# Altium schematic sheet keycard.SchDoc
size A; SheetNumber: 1; SheetTotal: 1
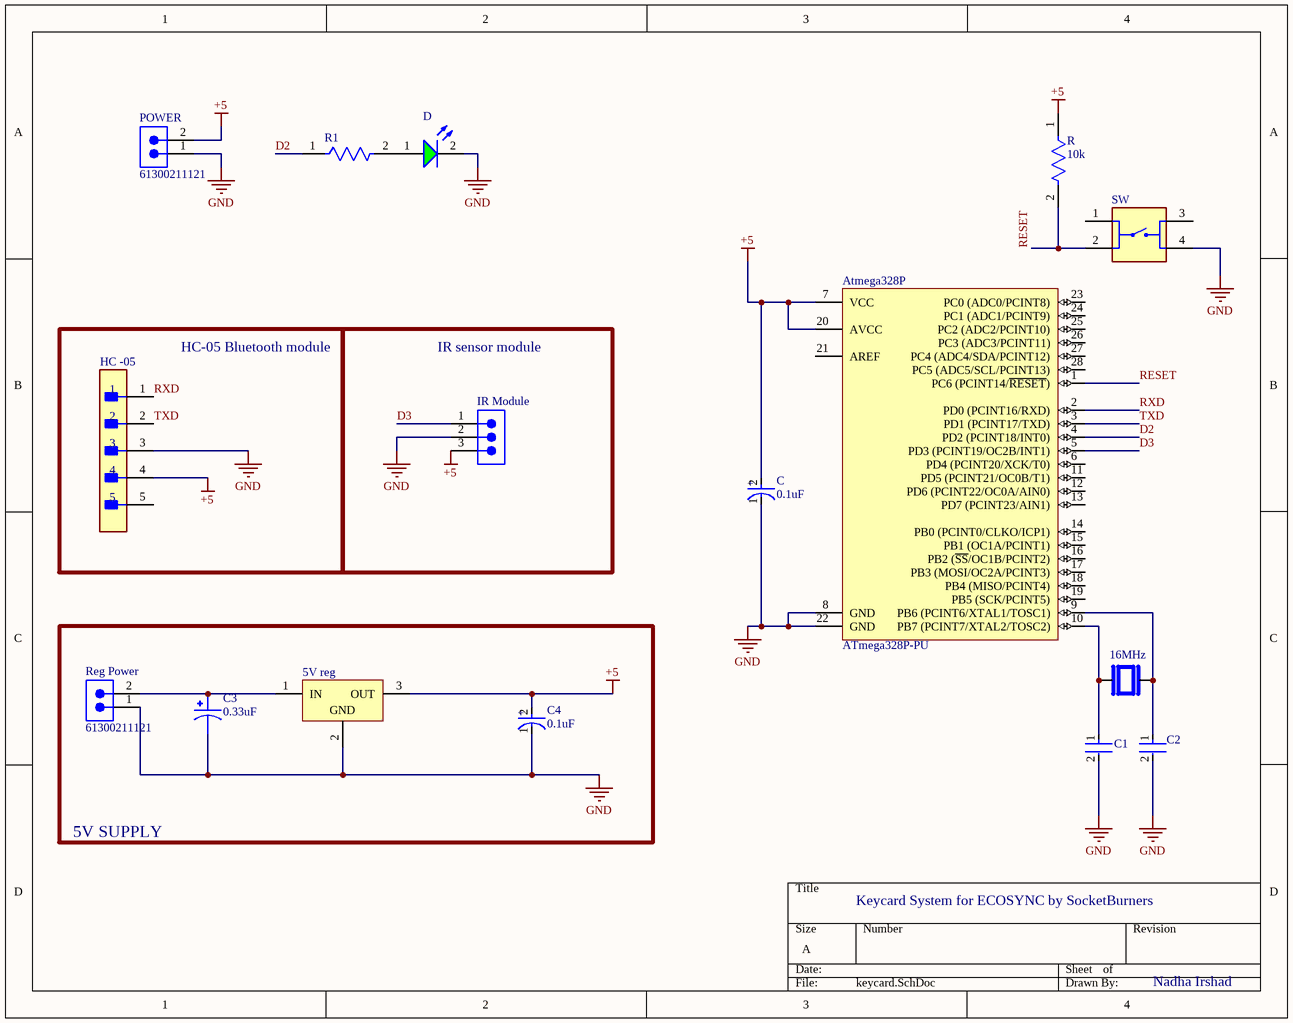
[diagram p0: keycard.SchDoc]

## Parts
5V_reg  L7805CV  [TO220]  (value not drawn)
16MHz  ABL-16.000MHZ-B2  [XTAL_HC49P488W46L1150T500H350]  (value not drawn)
Atmega328P  ATmega328P-PU  [28P3]
C  0.1uF  [FP-RAD-TH-D_6_3_0_5-L_11-MFG]
C1  RDE5C2A220J0M1H03A  [FP-RDE0M1-MFG]  (value not drawn)
C2  RDE5C2A220J0M1H03A  [FP-RDE0M1-MFG]  (value not drawn)
C3  0.33uF  [CAPPRD200W50D550H1250]
C4  0.1uF  [FP-RAD-TH-D_6_3_0_5-L_11-MFG]
D  151031VS06000  [WL-TMRC_D3.95H5.3]  (value not drawn)
HC_-05  22-28-4050  [FP-22-28-4050-MFG]  (value not drawn)
IR_Module  61300311121  [61300311121]  (value not drawn)
POWER  61300211121  [61300211121]
R  10k  [FP-CF18-MFG]
R1  CF18JT10K0  [FP-CF18-MFG]  (value not drawn)
Reg_Power  61300211121  [61300211121]
SW  1825910-6  [SW_1825910-6-4]  (value not drawn)

## Blocks framed on the sheet
HC-05 Bluetooth module: HC_-05
IR sensor module: IR_Module
5V SUPPLY: 5V_reg C3 C4 Reg_Power

## Nets
+5: 5V_reg.3(OUT) Atmega328P.7(VCC) Atmega328P.20(AVCC) C.2(A) C4.2(A) HC_-05.4 IR_Module.3 POWER.2 R.1
GND: 5V_reg.2(GND) Atmega328P.8(GND) Atmega328P.22(GND) C.1(C) C1.2 C2.2 C3.2 C4.1(C) D.2(K) HC_-05.3 IR_Module.2 POWER.1 Reg_Power.1 SW.4
D2: Atmega328P.4(PD2_(PCINT18/INT0)) R1.1
D3: Atmega328P.5(PD3_(PCINT19/OC2B/INT1)) IR_Module.1
RESET: Atmega328P.1(PC6_(PCINT14/~{RESET})) R.2 SW.2
RXD: Atmega328P.2(PD0_(PCINT16/RXD)) HC_-05.1
TXD: Atmega328P.3(PD1_(PCINT17/TXD)) HC_-05.2
Net5V_reg_1: 5V_reg.1(IN) C3.1 Reg_Power.2
Net16MHz_1: 16MHz.1 Atmega328P.10(PB7_(PCINT7/XTAL2/TOSC2)) C1.1
Net16MHz_2: 16MHz.2 Atmega328P.9(PB6_(PCINT6/XTAL1/TOSC1)) C2.1
NetD_1: D.1(A) R1.2

Not connected (* = marked no-connect by the designer): Atmega328P 6(PD4_(PCINT20/XCK/T0)) 11(PD5_(PCINT21/OC0B/T1)) 12(PD6_(PCINT22/OC0A/AIN0)) 13(PD7_(PCINT23/AIN1)) 14(PB0_(PCINT0/CLKO/ICP1)) 15(PB1_(OC1A/PCINT1)) 16(PB2_(~{SS}/OC1B/PCINT2)) 17(PB3_(MOSI/OC2A/PCINT3)) 18(PB4_(MISO/PCINT4)) 19(PB5_(SCK/PCINT5)) 21(AREF) 23(PC0_(ADC0/PCINT8)) 24(PC1_(ADC1/PCINT9)) 25(PC2_(ADC2/PCINT10)) 26(PC3_(ADC3/PCINT11)) 27(PC4_(ADC4/SDA/PCINT12)) 28(PC5_(ADC5/SCL/PCINT13)); HC_-05 5; SW 1 3

## Notes on the sheet
- Keycard System for ECOSYNC by SocketBurners
- Nadha Irshad
- (in symbol CMP-05427-001214-1) +

## Library data of the parts
5V_reg = CMP-0244-00483-1: Positive Voltage Regulator, 5V, 3-Pin TO-220; PackageDescription: TO, Thru-Hole, Vertical, Heatsink Mounted; 3 In-Line Leads; Pitch 2.54 mm; ComponentLink2Description: Datasheet; PackageReference: TO220; ComponentLink3URL: http://www.st.com/internet/com/TECHNICAL_RESOURCES/TECHNICAL_LITERATURE/PACKAGE_INFORMATION/CD00004649.pdf; DatasheetVersion: 16/11/2011; ComponentLink1Description: Manufacturer URL; ComponentLink1URL: http://www.st.com; PackageVersion: ver3.0; ComponentLink3Description: Package Specification; ComponentLink2URL: http://www.st.com/internet/com/TECHNICAL_RESOURCES/TECHNICAL_LITERATURE/DATASHEET/CD00000444.pdf
16MHz = ABL-16.000MHZ-B2: HC/49US (AT49) MICROPROCESSOR CRYSTAL; MF: Abracon; Availability: In Stock; SnapEDA_Link: https://www.snapeda.com/parts/ABL-16.000MHZ-B2/Abracon+LLC/view-part/?ref=snap; MP: ABL-16.000MHZ-B2; Price: None; Value: *; Check_prices: https://www.snapeda.com/parts/ABL-16.000MHZ-B2/Abracon+LLC/view-part/?ref=eda; Purchase-URL: https://pricing.snapeda.com/search/part/ABL-16.000MHZ-B2/?ref=eda; Package: HC-49/US ABRACON
Atmega328P = CMP-0095-00013-2: 8-bit AVR Microcontroller, 32KB Flash, 1KB EEPROM, 2KB SRAM, 28-pin PDIP, Industrial Grade (-40°C to 85°C); RevisionNote: DatasheetVersion updated. URLs added.; PackageVersion: revB, Sep-2001; PackageDescription: 28-lead (0.300"/7.62mm Wide) Plastic Dual Inline Package (PDIP); DatasheetVersion: revD, May-2011; ComponentLink1Description: Manufacturer URL; ComponentLink1URL: http://www.atmel.com/; PackageReference: 28P3; ComponentLink2Description: ATmega48A/48PA/88A/88PA/168A/168PA/328/328P Datasheet; ComponentLink3URL: http://www.atmel.com/dyn/resources/prod_documents/8271S.pdf; ComponentLink2URL: http://www.atmel.com/dyn/resources/prod_documents/8271.pdf; ComponentLink3Description: ATmega48A/48PA/88A/88PA/168A/168PA/328/328P Summary
C C4 = CMP-05427-001214-1: Aluminum Electrolytic Capacitors (Radial Lead Type) 330uF ±20% 6.3V; ESR (Equivalent Series Resistance): 130mR; Lead Diameter: 0.5mm; Ripple Current: 455mA; Polarity: Polar; Life (Hours): 2000Hour; Package Quantity: 2000; RoHS Compliant: Yes; Diameter: 6.3mm; Features: General Purpose; Voltage Rating: 6.3V; Length: 11.2mm; Voltage Rating (DC): 6.3V; Mount: Through Hole; Min Operating Temperature: -40°C; Height: 11.2mm; Termination: Radial; Radiation Hardening: No; Capacitance: 330uF; Case/Package: Radial; Packaging: Ammo Pack; Tolerance: 20%; Height - Seated (Max): 0.5inch; Series: FR; Lead Pitch: 5mm; Max Operating Temperature: 105°C; Impedance: 130mR
C1 C2 = CMP-06035-022985-1: Ceramic Capacitor 22pF ±5% 100V C0G Radial; Lead Diameter: 0.5mm; Mount: Through Hole; Min Operating Temperature: -55°C; Height: 3.5mm; Width: 0.098inch; Packaging: Cut Tape; Resistor Type: Ceramic; Case/Package: Radial; Capacitance: 22pF; Voltage Rating: 100V; Height - Seated (Max): 0.236inch; Max Operating Temperature: 125°C; Dielectric: C0G; Package Quantity: 1; Voltage Rating (DC): 100V; Lead Free: Lead Free; Lead Pitch: 0.197inch; Termination: Radial; Tolerance: 5%; Length: 0.157inch
C3 = UVR2AR33MDD: CAP ALUM 0.33UF 20% 100V RADIAL; MF: Nichicon; MP: UVR2AR33MDD; Value: *; Availability: Warning; Package: Radial Nichicon; DigiKey-Purchase-URL: https://snapeda.com/shop?store=DigiKey&id=2320026; Mouser-Purchase-URL: https://snapeda.com/shop?store=Mouser&id=2320026; SnapEDA_Link: https://www.snapeda.com/parts/UVR2AR33MDD/Nichicon/view-part/2320026/?ref=snap; Price: None; Check_prices: https://www.snapeda.com/parts/UVR2AR33MDD/Nichicon/view-part/2320026/?ref=eda
D = CMP-1488-00004-2: NexarPartId: 29717805; Peak Wavelength: 560nm; Lens Style: Circular, Diffused, Round; Forward Voltage: 2.2V; Lens Size: 3mm; Wavelength: 568nm; Test Current: 20mA; Max Reverse Voltage (DC): 5V; Forward Current: 100mA; Viewing Angle: 60°; Luminous Intensity: 30mcd; Case/Package: Radial; RoHS: Compliant; Packaging: Bulk; Max Operating Temperature: 85°C; Lead Free: Lead Free; Min Operating Temperature: -40°C; Length: 3mm; Width: 3mm; Color: Green; REACH SVHC: Unknown; Mount: Through Hole; Height: 5.3mm; Dominant Wavelength: 568nm
HC_-05 = CMP-00257-00278173-1: 22-28-4050 KK® 254 Breakaway Header, Vertical, 5 Circuits, Tin (Sn) Plating, Mating Pin Length 6.09mm; NexarPartId: 278173; Voltage Rating: 250V; Number of Contacts: 5; Contact Resistance: 20mΩ; Gender: Male; Pitch: 2.54mm; Connector Type: Male Pin; Current Rating: 4A; Glow Wire Compliant: Non-compliant; Max Voltage Rating (DC): 250.25kV; Flammability Rating: UL94 V-0; Min Operating Temperature: 0°C; REACH SVHC: Unknown; Lead Free: Lead Free; Termination: Solder; RoHS: Compliant; Schedule B: 8536694040; Number of Circuits: 5; Mount: Through Hole; Lead Pitch: 2.54mm; Height: 2.29mm; Voltage Rating (DC): 250V; Max Operating Temperature: 75°C; Width: 2.49mm; Radiation Hardening: No; Contact Plating: Tin; Orientation: Vertical; Length: 12.7mm; Number of Rows: 1; Housing Material: Thermoplastic; Contact Material: Brass; Packaging: Bulk; Contact Mating Length: 6.096mm; Housing Color: Black; Color: Black; Number of Positions: 5
IR_Module = CMP-1502-01062-3: NexarPartId: 32855521; Current Rating: 3A; Voltage Rating: 250V; Number of Positions: 3; Pitch: 2.54mm; Contact Resistance: 20mΩ; Connector Type: Male Pin; Gender: Male; REACH SVHC: Unknown; Packaging: Bulk; Contact Material: Copper; Min Operating Temperature: -40°C; Number of Rows: 1; Orientation: Vertical; RoHS: Compliant; Contact Plating: Gold; Max Operating Temperature: 105°C; Mount: Through Hole; Height: 8.94mm; Operating Supply Voltage: 250V; Number of Pins: 3; Contact Mating Length: 5.9944mm; Number of Contacts: 3; Color: Black; Lead Free: Lead Free; Lead Pitch: 2.54mm; Termination: Solder
POWER Reg_Power = CMP-1712-00002-6: NexarPartId: 20081794; Number of Contacts: 2; Pitch: 2.54mm; Connector Type: Male Pin; Voltage Rating: 250V; Current Rating: 3A; Gender: Male; Contact Resistance: 20mΩ; Height: 8.94mm; Lead Free: Lead Free; Number of Pins: 2; Termination: Through Hole; RoHS: Compliant; Lead Pitch: 2.54mm; REACH SVHC: No SVHC; Housing Material: PBT; Contact Mating Length: 5.9944mm; Min Operating Temperature: -40°C; Orientation: Vertical; Contact Material: Copper; Contact Gender: Male; Max Operating Temperature: 125°C; Number of Rows: 1; Number of Positions: 2; Packaging: Bulk; Contact Plating: Gold; Mount: Through Hole; Color: Black; Operating Supply Voltage: 250V
R = CMP-26528-000002-1: RES 10K OHM 1/8W 5% CF AXIAL; Manufacturer Part Number: CF18JT10K0; Manufacturer: Stackpole Electronics; Power Rating: 0.125W; Temperature Coefficient: 0-500ppm/°C; Resistance: 10kΩ; Voltage Rating: 250V; Value: 10kΩ; Temperature: -55°C to +155°C; Height: 2mm; Lead Free: Yes; Automotive: No; Device Class L2: Resistors; Package: CF18; Series: CF; ComponentLink2Description: Datasheet; Ipc Land Pattern Name: RESAD656W65L360D200; Temperature Range High: +155°C; RoHS: TRUE; Device Class L3: Through-Hole Resistors; Temperature Range Low: -55°C; Device Class L1: Passive Components; Category: Res; Octopart: https://octopart.com/cf18jt10k0-stackpole+electronics-19205642; Composition: Carbon Film; Digikey Description: RES 10K OHM 1/8W 5% CF AXIAL; ComponentLink2URL: http://www.seielect.com/Catalog/SEI-CF_CFM.pdf; Tolerance: 5%
R1 = CMP-26528-000002-1: RES 10K OHM 1/8W 5% CF AXIAL; Manufacturer: Stackpole Electronics; Power Rating: 0.125W; Temperature Coefficient: 0-500ppm/°C; Resistance: 10kΩ; Voltage Rating: 250V; Value: 10kΩ; Temperature: -55°C to +155°C; Height: 2mm; Lead Free: Yes; Automotive: No; Device Class L2: Resistors; Package: CF18; Series: CF; ComponentLink2Description: Datasheet; Ipc Land Pattern Name: RESAD656W65L360D200; Manufacturer Part Number: CF18JT10K0; Temperature Range High: +155°C; RoHS: TRUE; Device Class L3: Through-Hole Resistors; Temperature Range Low: -55°C; Device Class L1: Passive Components; Category: Res; Octopart: https://octopart.com/cf18jt10k0-stackpole+electronics-19205642; Composition: Carbon Film; Digikey Description: RES 10K OHM 1/8W 5% CF AXIAL; ComponentLink2URL: http://www.seielect.com/Catalog/SEI-CF_CFM.pdf; Tolerance: 5%
SW = 1825910-6: Switch Push Button OFF (ON) SPST Round Button 0.05A 24VDC Momentary Contact PC Pins Thru-Hole; MF: TE Connectivity; Value: *; MP: 1825910-6; Package: None; Check_prices: https://www.snapeda.com/parts/1825910-6/TE+Connectivity+ALCOSWITCH+Switches/view-part/?ref=eda; SnapEDA_Link: https://www.snapeda.com/parts/1825910-6/TE+Connectivity+ALCOSWITCH+Switches/view-part/?ref=snap; Digi-Key_Part_Number: 450-1650-ND; Purchase-URL: https://pricing.snapeda.com/search/part/1825910-6/?ref=eda